# Altium schematic sheet Alimentacion.SchDoc
size A3; SheetNumber: 2; SheetTotal: 6
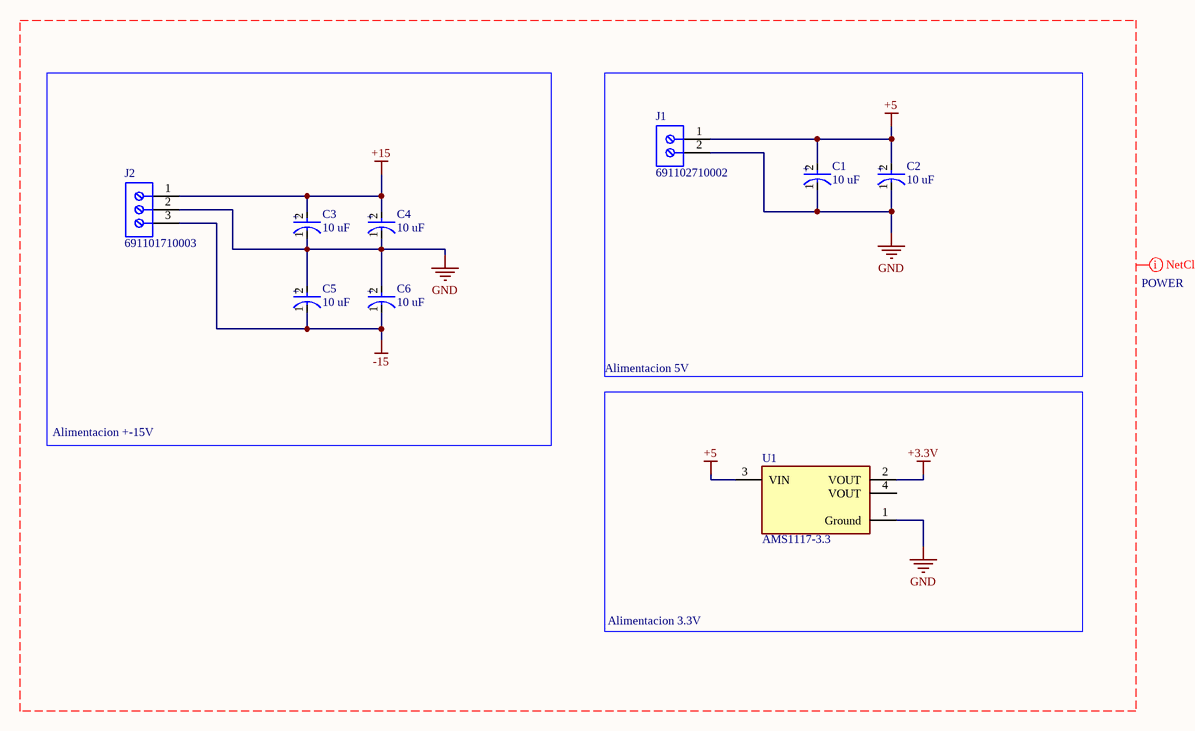
[diagram p0: Alimentacion.SchDoc]

## Parts
C1  10 uF  [FP-RAD-TH-D_5_0_5-L_11_1-MFG]
C2  10 uF  [FP-RAD-TH-D_5_0_5-L_11_1-MFG]
C3  10 uF  [FP-RAD-TH-D_5_0_5-L_11_1-MFG]
C4  10 uF  [FP-RAD-TH-D_5_0_5-L_11_1-MFG]
C5  10 uF  [FP-RAD-TH-D_5_0_5-L_11_1-MFG]
C6  10 uF  [FP-RAD-TH-D_5_0_5-L_11_1-MFG]
J1  691102710002  [691102710002]
J2  691101710003  [691101710003]
U1  AMS1117-3.3  [FP-AMS1117-IPC_C]

## Blocks framed on the sheet
Alimentacion +-15V: C3-C6 J2
Alimentacion 5V: C1 C2 J1

## Nets
+3.3V: U1.2(VOUT)
+5: C1.2(A) C2.2(A) J1.1 U1.3(VIN)
+15: C3.2(A) C4.2(A) J2.1
-15: C5.1(C) C6.1(C) J2.3
GND: C1.1(C) C2.1(C) C3.1(C) C4.1(C) C5.2(A) C6.2(A) J1.2 J2.2 U1.1(Ground)

Not connected (* = marked no-connect by the designer): U1 4(VOUT)

## Layout directives
net class POWER; rule Width Constraint [Pref Width = 0.5mm    Min Width = 0.5mm    Max Width = 1mm]: +3.3V, +5, +15, -15, GND

## Notes on the sheet
- Alimentacion 3.3V
- (in symbol CMP-05427-001517-1) +

## Library data of the parts
C1-C6 = CMP-05427-001517-1: Aluminum Electrolytic Capacitors (Radial Lead Type) 10uF ±20% 63V; Life (Hours): 2000Hour; Dielectric Material: Aluminium; Lead/Base Style: Straight; Ripple Current: 70mA; Dissipation Factor: 0.11%; Leakage Current: 3uA; Lead Diameter: 0.5mm; Max Operating Temperature: 85°C; Capacitance: 10uF; Voltage Rating: 63V; Packaging: Bulk; Radiation Hardening: No; Tolerance: 20%; Height: 11mm; Mount: Through Hole; Voltage: 63V; Voltage Rating (DC): 63V; Lead Pitch: 2mm; RoHS Compliant: Yes; Diameter: 5mm; Package Quantity: 200; Length: 11mm; Case/Package: Radial; Min Operating Temperature: -40°C; Construction: RADIAL; Height - Seated (Max): 0.472inch; Lead Free: Lead Free; Termination: Radial; Width: 5mm; Series: M; REACH SVHC: No SVHC
J1 = CMP-1502-03258-2: NexarPartId: 8917706; Number of Levels: 1; Number of Positions Per Level: 2; Current: 15A; Voltage: 300V; Pitch: 5.0038mm; Plating: Steel; Stripping Length: -6mm; Wire Gauge (Min): 14AWG; Wire Gauge (Max): 22AWG; Length: 7.5mm; Contact Material: Brass; Contact Plating: Tin; Packaging: Box; Number of Pins: 2; Voltage Rating: 300V; Termination: Screw; Number of Contacts: 2; Color: Blue; Current Rating: 15A; Mount: Through Hole; Max Operating Temperature: 105°C; Min Operating Temperature: -40°C; REACH SVHC: Unknown; Height: 13.4mm; Width: 11.2mm; Housing Material: Nylon; RoHS: Compliant; Wire/Cable Gauge: 22AWG; Lead Pitch: 5mm
J2 = CMP-1502-03257-2: NexarPartId: 8917705; Voltage Rating: 250V; Current: 16A; Wire Gauge (Min): 14AWG; Pitch: 5.0038mm; Wire Gauge (Max): 26AWG; Number of Positions Per Level: 3; Plating: Steel; Number of Levels: 1; Stripping Length: -7mm; REACH SVHC: Unknown; Width: 16.2mm; Height: 16.4mm; Contact Material: Brass; RoHS: Compliant; Color: Blue; Contact Plating: Tin; Lead Pitch: 5mm; Packaging: Box; Termination: Screw; Number of Contacts: 3; Wire/Cable Gauge: 26AWG; Min Operating Temperature: -40°C; Max Operating Temperature: 105°C; Housing Material: Nylon; Length: 9mm; Voltage: 250V; Mount: Through Hole; Current Rating: 16A; Number of Pins: 3
U1 = CMP-209535-000001-1: LDO Voltage Regulators 1A, 3.3V; Manufacturer: Advanced Monolithic Systems; Dropout Voltage: 1.1V; Output Type: Fixed; Nominal Supply Current: 5mA; Max Power Dissipation: 1.2W; Max Supply Voltage: 15V; Number Of Outputs: 1; Standoff Height: 0.64mm; Max Junction Temp: +125°C; Height: 1.8mm; Package: AMS1117; Device Class L2: Power Management ICs; ComponentLink2Description: Datasheet; ComponentLink2URL: http://www.advanced-monolithic.com/pdf/ds1117.pdf; Category: IC; RoHS: TRUE; Automotive: No; Device Class L1: Integrated Circuits (ICs); Output Current: 1A; Device Class L3: Voltage Regulators - Linear; Temperature: -40°C to +125°C; Output Voltage: 3.3V; Manufacturer Part Number: AMS1117-3.3; Temperature Range Low: -40°C; Octopart: https://octopart.com/ams1117-3.3-advanced+monolithic+systems-25899300; Lead Free: Yes; Ipc Land Pattern Name: SOT229P700X180-4; Temperature Range High: +125°C